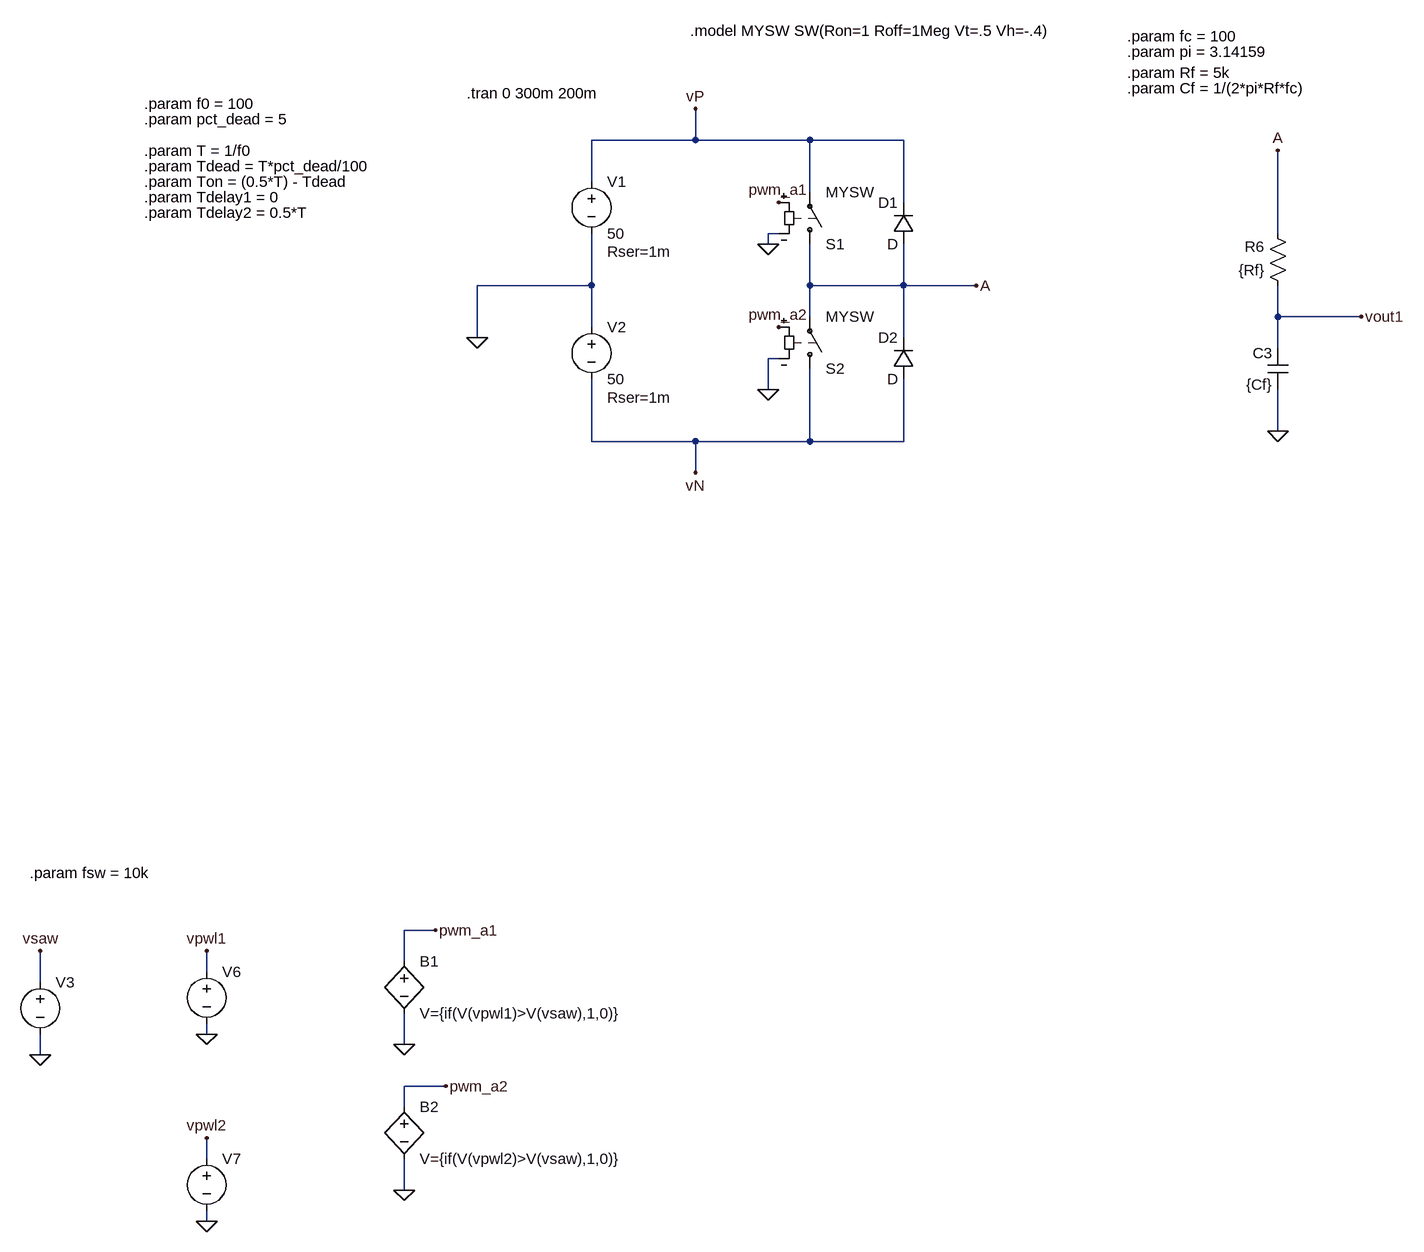
[diagram p0: schematic grid_sim_01.asc]
grid_sim_01.asc, the LTspice schematic file:
Version 4
SHEET 1 1616 1852
WIRE 96 32 96 -16
WIRE 96 32 -64 32
WIRE 272 32 96 32
WIRE 416 32 272 32
WIRE -64 96 -64 32
WIRE 272 112 272 32
WIRE 416 128 416 32
WIRE 224 176 208 176
WIRE 992 176 992 48
WIRE 208 192 208 176
WIRE -64 256 -64 176
WIRE -64 256 -240 256
WIRE 272 256 272 192
WIRE 416 256 416 192
WIRE 416 256 272 256
WIRE 528 256 416 256
WIRE 272 304 272 256
WIRE 992 304 992 256
WIRE 1120 304 992 304
WIRE -64 320 -64 256
WIRE -240 336 -240 256
WIRE 416 336 416 256
WIRE 992 352 992 304
WIRE 224 368 208 368
WIRE 208 416 208 368
WIRE 992 480 992 416
WIRE -64 496 -64 400
WIRE 96 496 -64 496
WIRE 272 496 272 384
WIRE 272 496 96 496
WIRE 416 496 416 400
WIRE 416 496 272 496
WIRE 96 544 96 496
WIRE -304 1248 -352 1248
WIRE -352 1296 -352 1248
WIRE -656 1312 -656 1280
WIRE -912 1328 -912 1280
WIRE -656 1408 -656 1392
WIRE -352 1424 -352 1376
WIRE -912 1440 -912 1408
WIRE -288 1488 -352 1488
WIRE -352 1520 -352 1488
WIRE -656 1600 -656 1568
WIRE -352 1648 -352 1600
WIRE -656 1696 -656 1680
FLAG -240 336 0
FLAG 528 256 A
FLAG 992 48 A
FLAG 96 -16 vP
FLAG 96 544 vN
FLAG 992 480 0
FLAG -912 1440 0
FLAG -912 1280 vsaw
FLAG -656 1408 0
FLAG -656 1280 vpwl1
FLAG -656 1696 0
FLAG -656 1568 vpwl2
FLAG -304 1248 pwm_a1
FLAG 1120 304 vout1
FLAG -288 1488 pwm_a2
FLAG 208 416 0
FLAG 208 192 0
FLAG -352 1424 0
FLAG -352 1648 0
FLAG 224 128 pwm_a1
FLAG 224 320 pwm_a2
SYMBOL voltage -64 80 R0
WINDOW 123 0 0 Left 0
WINDOW 39 24 124 Left 2
SYMATTR SpiceLine Rser=1m
SYMATTR InstName V1
SYMATTR Value 50
SYMBOL voltage -64 304 R0
WINDOW 123 0 0 Left 0
WINDOW 39 24 124 Left 2
SYMATTR SpiceLine Rser=1m
SYMATTR InstName V2
SYMATTR Value 50
SYMBOL res 1008 272 R180
WINDOW 0 36 76 Left 2
WINDOW 3 36 40 Left 2
SYMATTR InstName R6
SYMATTR Value {Rf}
SYMBOL cap 1008 416 R180
WINDOW 0 24 56 Left 2
WINDOW 3 24 8 Left 2
SYMATTR InstName C3
SYMATTR Value {Cf}
SYMBOL voltage -912 1312 R0
WINDOW 3 24 96 Invisible 2
WINDOW 123 0 0 Left 0
WINDOW 39 0 0 Left 0
SYMATTR Value PULSE(0 1 0 {0.999/fsw} 1n 1n {1/fsw} 1e12)
SYMATTR InstName V3
SYMBOL bv -352 1280 R0
SYMATTR InstName B1
SYMATTR Value V={if(V(vpwl1)>V(vsaw),1,0)}
SYMBOL voltage -656 1296 R0
WINDOW 3 24 96 Invisible 2
WINDOW 123 0 0 Left 0
WINDOW 39 0 0 Left 0
SYMATTR Value SINE(0 1 50 0 0 0 1e12)
SYMATTR InstName V6
SYMBOL bv -352 1504 R0
SYMATTR InstName B2
SYMATTR Value V={if(V(vpwl2)>V(vsaw),1,0)}
SYMBOL voltage -656 1584 R0
WINDOW 3 24 96 Invisible 2
WINDOW 123 0 0 Left 0
WINDOW 39 0 0 Left 0
SYMATTR Value SINE(0 1 50 0 0 180 1e12)
SYMATTR InstName V7
SYMBOL sw 272 208 M180
SYMATTR InstName S1
SYMATTR Value MYSW
SYMBOL sw 272 400 M180
SYMATTR InstName S2
SYMATTR Value MYSW
SYMBOL diode 432 192 R180
WINDOW 0 24 64 Left 2
WINDOW 3 24 0 Left 2
SYMATTR InstName D1
SYMBOL diode 432 400 R180
WINDOW 0 24 64 Left 2
WINDOW 3 24 0 Left 2
SYMATTR InstName D2
TEXT -752 -24 Left 2 !.param f0 = 100
TEXT -752 72 Left 2 !.param Tdead = T*pct_dead/100
TEXT -752 96 Left 2 !.param Ton = (0.5*T) - Tdead
TEXT -752 48 Left 2 !.param T = 1/f0
TEXT -752 120 Left 2 !.param Tdelay1 = 0
TEXT -752 144 Left 2 !.param Tdelay2 = 0.5*T
TEXT -256 -40 Left 2 !.tran 0 300m 200m
TEXT 760 -128 Left 2 !.param fc = 100
TEXT 760 -104 Left 2 !.param pi = 3.14159
TEXT 760 -48 Left 2 !.param Cf = 1/(2*pi*Rf*fc)
TEXT 760 -72 Left 2 !.param Rf = 5k
TEXT -752 0 Left 2 !.param pct_dead = 5
TEXT -928 1160 Left 2 !.param fsw = 10k
TEXT 88 -136 Left 2 !.model MYSW SW(Ron=1 Roff=1Meg Vt=.5 Vh=-.4)

The netlist it stands for:
* grid_sim_01.asc
V1 vP 0 50 Rser=1m
V2 0 vN 50 Rser=1m
R6 vout1 A {Rf}
C3 0 vout1 {Cf}
V3 vsaw 0 PULSE(0 1 0 {0.999/fsw} 1n 1n {1/fsw} 1e12)
B1 pwm_a1 0 V={if(V(vpwl1)>V(vsaw),1,0)}
V6 vpwl1 0 SINE(0 1 50 0 0 0 1e12)
B2 pwm_a2 0 V={if(V(vpwl2)>V(vsaw),1,0)}
V7 vpwl2 0 SINE(0 1 50 0 0 180 1e12)
S1 A vP pwm_a1 0 MYSW
S2 vN A pwm_a2 0 MYSW
D1 A vP D
D2 vN A D
.model D D
.lib standard.dio
.param f0 = 100
.param Tdead = T*pct_dead/100
.param Ton = (0.5*T) - Tdead
.param T = 1/f0
.param Tdelay1 = 0
.param Tdelay2 = 0.5*T
.tran 0 300m 200m
.param fc = 100
.param pi = 3.14159
.param Cf = 1/(2*pi*Rf*fc)
.param Rf = 5k
.param pct_dead = 5
.param fsw = 10k
.model MYSW SW(Ron=1 Roff=1Meg Vt=.5 Vh=-.4)
.backanno
.end